# Altium project DDS_PCB.PrjPcb
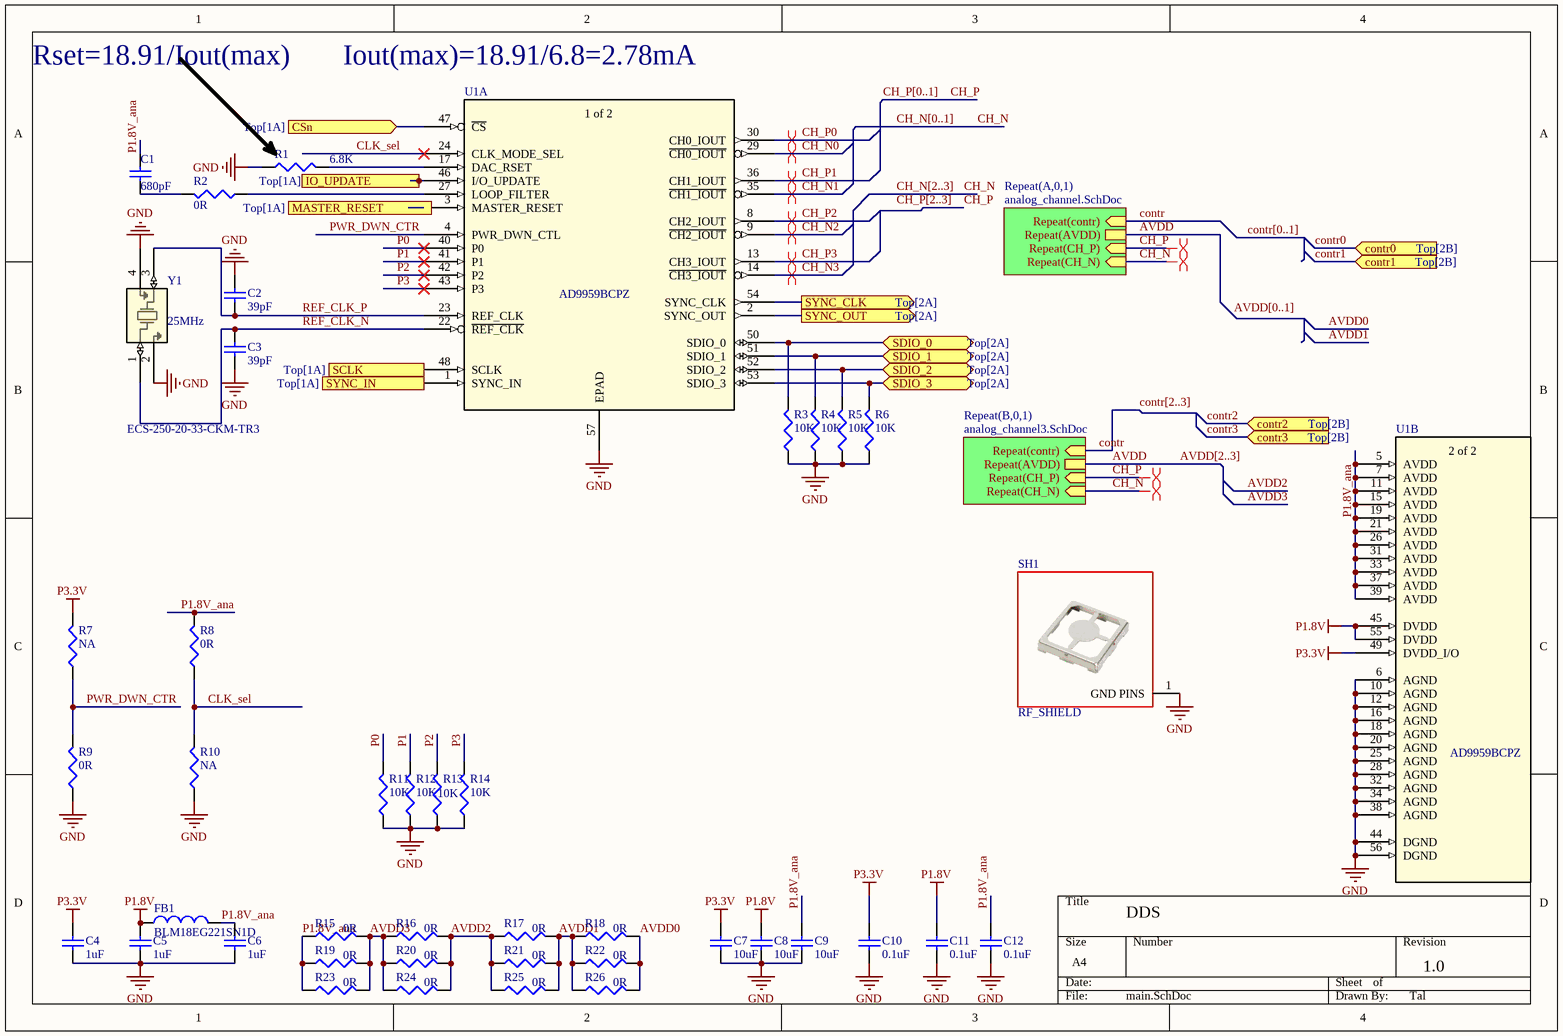
[diagram p0: main.SchDoc]
4 sheets, 213 parts. Net scope: hierarchical (ports join the sheet entries above them; power ports are global).
Board file: DDS_PCB.PcbDoc
Sheets:
  main.SchDoc
    A0 = analog_channel.SchDoc
    A1 = analog_channel.SchDoc
    B0 = analog_channel3.SchDoc
    B1 = analog_channel3.SchDoc
  power.SchDoc

## Sheet main.SchDoc
size A4; SheetNumber: 2; SheetTotal: 6; SPICEModelCacheQOCYWOGJ: <root> / <DocumentId>QOCYWOGJ</DocumentId> / </root>

### Parts
C1  Capacitance: 680pF  [C0402]  (hidden comment: 680pF 50V)
C2  Capacitance: 39pF  [C0402]  (hidden comment: 39pF 50V)
C3  Capacitance: 39pF  [C0402]  (hidden comment: 39pF 50V)
C4  Capacitance: 1uF  [C0402]  (hidden comment: 1uF 25V)
C5  Capacitance: 1uF  [C0402]  (hidden comment: 1uF 25V)
C6  Capacitance: 1uF  [C0402]  (hidden comment: 1uF 25V)
C7  Capacitance: 10uF  [C0402]  (hidden comment: 10uF 10V)
C8  Capacitance: 10uF  [C0402]  (hidden comment: 10uF 10V)
C9  Capacitance: 10uF  [C0402]  (hidden comment: 10uF 10V)
C10  Capacitance: 0.1uF  [C0402]  (hidden comment: 0.1uF 50V)
C11  Capacitance: 0.1uF  [C0402]  (hidden comment: 0.1uF 50V)
C12  Capacitance: 0.1uF  [C0402]  (hidden comment: 0.1uF 50V)
FB1  BLM18EG221SN1D  [fb0603]
R1  6.8K  [R0402]
R2  0R  [R0402]
R3  10K  [R0402]
R4  10K  [R0402]
R5  10K  [R0402]
R6  10K  [R0402]
R7  NA  [R0402]
R8  0R  [R0402]
R9  0R  [R0402]
R10  NA  [R0402]
R11  10K  [R0402]
R12  10K  [R0402]
R13  10K  [R0402]
R14  10K  [R0402]
R15  0R  [R0805]
R16  0R  [R0805]
R17  0R  [R0805]
R18  0R  [R0805]
R19  0R  [R0805]
R20  0R  [R0805]
R21  0R  [R0805]
R22  0R  [R0805]
R23  0R  [R0805]
R24  0R  [R0805]
R25  0R  [R0805]
R26  0R  [R0805]
SH1  RF_SHIELD  [SMS201F]
U1  AD9959BCPZ  [CP_56_1_ADI]  (parts A,B of 2)
Y1  ECS-250-20-33-CKM-TR3  [SMD4_ECX-32_3p2x2p5_ECS]

### Sub-sheets
Repeat(A,0,1) = analog_channel.SchDoc: Repeat(contr) (in), Repeat(AVDD), Repeat(CH_P) (in), Repeat(CH_N) (in)
Repeat(B,0,1) = analog_channel3.SchDoc: Repeat(contr) (in), Repeat(AVDD), Repeat(CH_P) (in), Repeat(CH_N) (in)

### Ports
contr0 (in, see Top[2B]), contr1 (in, see Top[2B]), contr2 (in, see Top[2B]), contr3 (in, see Top[2B]), CSn (in, see Top[1A]), IO_UPDATE (in, see Top[1A]), MASTER_RESET (in, see Top[1A]), SCLK (in, see Top[1A]), SDIO_0 (bidir, see Top[2A]), SDIO_1 (bidir, see Top[2A]), SDIO_2 (bidir, see Top[2A]), SDIO_3 (bidir, see Top[2A]), SYNC_CLK (out, see Top[2A]), SYNC_IN (in, see Top[1A]), SYNC_OUT (out, see Top[2A])

### Nets
GND: C2.2 C3.1 C4.1 C5.1 C6.1 C7.1 C8.1 C9.1 C10.1 C11.1 C12.1 R1.1 R3.1 R4.1 R5.1 R6.1 R9.1 R10.1 R11.1 R12.1 R13.1 R14.1 SH1.1(GND_PINS) U1.6(AGND) U1.10(AGND) U1.12(AGND) U1.16(AGND) U1.18(AGND) U1.20(AGND) U1.25(AGND) U1.28(AGND) U1.32(AGND) U1.34(AGND) U1.38(AGND) U1.44(DGND) U1.56(DGND) U1.57(EPAD) Y1.2 Y1.4
P1.8V: C5.2 C8.2 C11.2 FB1.1 U1.45(DVDD) U1.55(DVDD)
P3.3V: C4.2 C7.2 C10.2 R7.2 U1.49(DVDD_I/O)
AVDD: sheet Repeat(A,0,1)/Repeat(AVDD), sheet Repeat(B,0,1)/Repeat(AVDD)  [also labelled AVDD[2..3]]
AVDD0: R18.2 R22.2 R26.2  [also labelled AVDD[2..3]0]  [project net AVDD]
AVDD1: R17.2 R18.1 R21.2 R22.1 R25.2 R26.1  [also labelled AVDD[2..3]1]  [project net AVDD]
AVDD2: R16.2 R17.1 R20.2 R21.1 R24.2 R25.1
AVDD3: R15.2 R16.1 R19.2 R20.1 R23.2 R24.1
CH_N: sheet Repeat(A,0,1)/Repeat(CH_N), sheet Repeat(B,0,1)/Repeat(CH_N)
CH_N0: U1.29(~{CH0_IOUT})  [project net CH_N]
CH_N1: U1.35(~{CH1_IOUT})  [project net CH_N]
CH_N2: U1.9(~{CH2_IOUT})
CH_N3: U1.14(~{CH3_IOUT})
CH_P: sheet Repeat(A,0,1)/Repeat(CH_P), sheet Repeat(B,0,1)/Repeat(CH_P)
CH_P0: U1.30(CH0_IOUT)  [project net CH_P]
CH_P1: U1.36(CH1_IOUT)  [project net CH_P]
CH_P2: U1.8(CH2_IOUT)
CH_P3: U1.13(CH3_IOUT)
CLK_sel: R8.1 R10.2 U1.24(CLK_MODE_SEL)
contr: sheet Repeat(A,0,1)/Repeat(contr), sheet Repeat(B,0,1)/Repeat(contr)  [also labelled contr[2..3]]
contr2: port contr2
contr3: port contr3
CSn: U1.47(~{CS}) ; port CSn
IO_UPDATE: U1.46(I/O_UPDATE) ; port IO_UPDATE
P0: R11.2 U1.40(P0)
P1: R12.2 U1.41(P1)
P1.8V_ana: C1.1 C6.2 C9.2 C12.2 FB1.2 R8.2 R15.1 R19.1 R23.1 U1.5(AVDD) U1.7(AVDD) U1.11(AVDD) U1.15(AVDD) U1.19(AVDD) U1.21(AVDD) U1.26(AVDD) U1.31(AVDD) U1.33(AVDD) U1.37(AVDD) U1.39(AVDD)
P2: R13.2 U1.42(P2)
P3: R14.2 U1.43(P3)
PWR_DWN_CTR: R7.1 R9.2 U1.4(PWR_DWN_CTL)
REF_CLK_N: C3.2 U1.22(~{REF_CLK}) Y1.1
REF_CLK_P: C2.1 U1.23(REF_CLK) Y1.3
SCLK: U1.48(SCLK) ; port SCLK
SDIO_0: R3.2 U1.50(SDIO_0) ; port SDIO_0
SDIO_1: R4.2 U1.51(SDIO_1) ; port SDIO_1
SDIO_2: R5.2 U1.52(SDIO_2) ; port SDIO_2
SDIO_3: R6.2 U1.53(SDIO_3) ; port SDIO_3
SYNC_CLK: U1.54(SYNC_CLK) ; port SYNC_CLK
SYNC_IN: U1.1(SYNC_IN) ; port SYNC_IN
SYNC_OUT: U1.2(SYNC_OUT) ; port SYNC_OUT
NetC1_2: C1.2 R2.2
NetR1_2: R1.2 U1.17(DAC_RSET)
NetR2_1: R2.1 U1.27(LOOP_FILTER)

Not connected (* = marked no-connect by the designer): U1 3(MASTER_RESET)

### Buses and harness runs
bus AVDD[0..1]
bus CH_N[0..1]
bus CH_N[2..3]
bus CH_P[0..1]
bus CH_P[2..3]
bus contr[0..1]

### Layout directives
differential pair: CH_N, CH_N2, CH_N3, CH_P, CH_P2, CH_P3

### Notes on the sheet
- Rset=18.91/Iout(max)
- Iout(max)=18.91/6.8=2.78mA
- (near Y1) 25MHz
- DDS
- 1.0
- Tal
- Labels drawn without touching a wire or pin: CH_P[2..3]
- (in symbol AD9959BCPZ, part A) 1 of 2
- (in symbol AD9959BCPZ, part B) 2 of 2

### Library data of the parts
C1 = CAP CER 6.8pF 50V NP0 0402: CAP CER 680PF 50V NP0 0402; Manufacturer Part Number: C1005C0G1H6R8D; Manufacturer: TDK Corporation; LANDA P/N: ECP-000033; RoHS: RoHS Compliant; Package / Case: 0402 (1005 Metric); ComponentLink1URL: http://www.tdk.com/pdf/general_B11.pdf; ComponentLink1Description: http://www.tdk.com/pdf/general_B11.pdf; Voltage - Rated: 50V
C2 C3 = CAP CER 6.8pF 50V NP0 0402: CAP CER 39PF 50V NP0 0402; Manufacturer Part Number: C1005C0G1H6R8D; Manufacturer: TDK Corporation; LANDA P/N: ECP-000033; RoHS: RoHS Compliant; Package / Case: 0402 (1005 Metric); ComponentLink1URL: http://www.tdk.com/pdf/general_B11.pdf; ComponentLink1Description: http://www.tdk.com/pdf/general_B11.pdf; Voltage - Rated: 50V
C4-C6 = CAP CER 6.8pF 50V NP0 0402: CAP CER 1uF 25V X5R 0402; Manufacturer Part Number: C1005C0G1H6R8D; Manufacturer: TDK Corporation; LANDA P/N: ECP-000033; Voltage - Rated: 50V; RoHS: RoHS Compliant; Package / Case: 0402 (1005 Metric); ComponentLink1URL: http://www.tdk.com/pdf/general_B11.pdf; ComponentLink1Description: http://www.tdk.com/pdf/general_B11.pdf
C7-C9 = CAP CER 6.8pF 50V NP0 0402: CAP CER 10uF 10V X5R 0402; Manufacturer Part Number: C1005C0G1H6R8D; Manufacturer: TDK Corporation; LANDA P/N: ECP-000033; Voltage - Rated: 50V; RoHS: RoHS Compliant; Package / Case: 0402 (1005 Metric); ComponentLink1URL: http://www.tdk.com/pdf/general_B11.pdf; ComponentLink1Description: http://www.tdk.com/pdf/general_B11.pdf
C10-C12 = CAP CER 6.8pF 50V NP0 0402: CAP CER 0.1uF 50V NP0 0402; Manufacturer Part Number: C1005C0G1H6R8D; Manufacturer: TDK Corporation; LANDA P/N: ECP-000033; RoHS: RoHS Compliant; Package / Case: 0402 (1005 Metric); ComponentLink1URL: http://www.tdk.com/pdf/general_B11.pdf; ComponentLink1Description: http://www.tdk.com/pdf/general_B11.pdf; Voltage - Rated: 50V
FB1 = BK1608HS600-T: FERRITE BEAD 220_OHM@100MHz 0603 2A 50mohm_DC; Manufacturer: Taiyo Yuden; LANDA P/N: EIN-000010; RoHS: RoHS Compliant; Package / Case: 0603 (1608 Metric); ComponentLink1URL: http://www.yuden.co.jp/ut/product/category/emisuppression/BK1608HS600-T.pdf; ComponentLink1Description: http://www.yuden.co.jp/ut/product/category/emisuppression/BK1608HS600-T.pdf; Manufacturer Part Number: BLM18EG221SN1D
R1 = RES 3.09K OHM 1/16W 1% 0402: RES 6.8K OHM 1/16W 1% 0402; Manufacturer Part Number: RMCF0402FT3K09; Manufacturer: Stackpole Electronics Inc; Power (Watts): 0.063W, 1/16W; LANDA P/N: ERS-000063; Supplier Device Package: 0402; Package / Case: 0402 (1005 Metric); RoHS: RoHS Compliant; ComponentLink1URL: http://www.seielect.com/Catalog/SEI-RMCF_RMCP.pdf; ComponentLink1Description: http://www.seielect.com/Catalog/SEI-RMCF_RMCP.pdf
R2 R7-R10 = RES 100 OHM 1/10W 1% 0402 SMD: RES 0 OHM 1/10W 1% 0402 SMD; Manufacturer Part Number: ERJ-2RKF1000X; Manufacturer: Panasonic Electronic Components; LANDA P/N: ERS-000079; Assembly: N.C; Package / Case: 0402 (1005 Metric); RoHS: RoHS Compliant; ComponentLink1URL: http://industrial.panasonic.com/www-cgi/jvcr13pz.cgi?E+PZ+3+AOA0002+ERJ2RKF1000X+7+WW; ComponentLink1Description: http://industrial.panasonic.com/www-cgi/jvcr13pz.cgi?E+PZ+3+AOA0002+ERJ2RKF1000X+7+WW; Supplier Device Package: 0402
R3-R6 R11-R14 = RES 3.09K OHM 1/16W 1% 0402: RES 10K OHM 1/16W 1% 0402; Manufacturer Part Number: RMCF0402FT3K09; Manufacturer: Stackpole Electronics Inc; Power (Watts): 0.063W, 1/16W; LANDA P/N: ERS-000063; Supplier Device Package: 0402; Package / Case: 0402 (1005 Metric); RoHS: RoHS Compliant; ComponentLink1URL: http://www.seielect.com/Catalog/SEI-RMCF_RMCP.pdf; ComponentLink1Description: http://www.seielect.com/Catalog/SEI-RMCF_RMCP.pdf
R15-R26 = RES 200 OHM 1/8W 1% 0805 SMD: RES 0 OHM 1/8W 1% 0805 SMD; Manufacturer Part Number: RMCF0805FT200R; Manufacturer: Stackpole Electronics Inc; Power (Watts): 0.125W, 1/8W; LANDA P/N: ERS-000050; Package / Case: 0805 (2012 Metric); RoHS: RoHS Compliant; Supplier Device Package: 0805; ComponentLink1URL: http://www.seielect.com/Catalog/SEI-RMCF_RMCP.pdf; ComponentLink1Description: http://www.seielect.com/Catalog/SEI-RMCF_RMCP.pdf
SH1 = RF_SHIELD: RF SHIELD 0.5" X 0.538" SMD; Manufacturer_Part_Number: SMS-201F; Manufacturer: Leader Tech Inc.; ComponentLink1Description: Datasheet; ComponentLink1URL: https://www.leadertechinc.com/assets/files/EngineeringDrawings/SMS-201.pdf
U1 = AD9959BCPZ: No Description Available; Mfr_Name: Analog Devices Inc; Copyright: Copyright (C) 2023 Ultra Librarian. All rights reserved.; Manufacturer_Part_Number: AD9959BCPZ; RefDes: RefDes; Type: DEV
Y1 = ECS-250-20-33-CKM-TR3: No Description Available; Mfr_Name: ECS International; Type: DEV; Copyright: Copyright (C) 2023 Ultra Librarian. All rights reserved.; Manufacturer_Part_Number: ECS-250-20-33-CKM-TR3; RefDes: RefDes

## Sheet analog_channel.SchDoc
size A4; SheetNumber: 3; SheetTotal: 6
Used 2 times, as channels A0, A1. Parts and nets are listed once, with the designators drawn on the sheet.
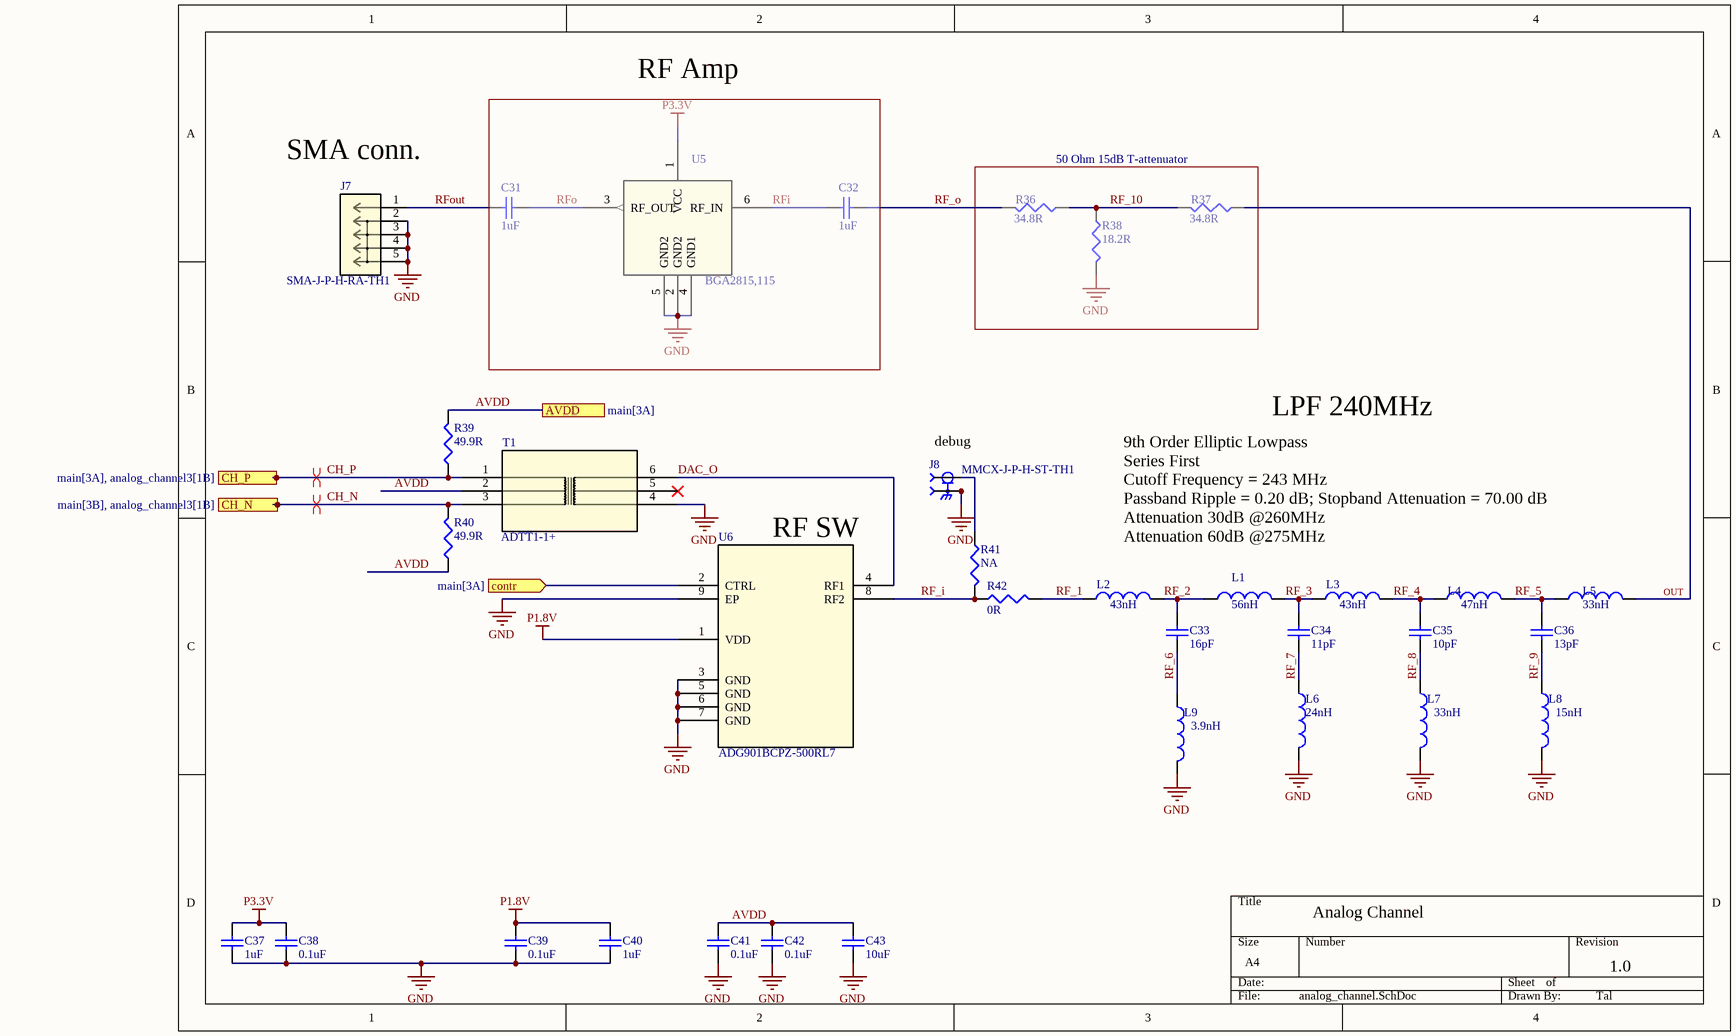
[diagram p1: analog_channel.SchDoc]

### Parts
C31  Capacitance: 1uF  [C0402]  (hidden comment: 1uF 25V)
C32  Capacitance: 1uF  [C0402]  (hidden comment: 1uF 25V)
C33  Capacitance: 16pF  [C0402]  (hidden comment: 16pF 50V)
C34  Capacitance: 11pF  [C0402]  (hidden comment: 11pF 50V)
C35  Capacitance: 10pF  [C0402]  (hidden comment: 10pF 50V)
C36  Capacitance: 13pF  [C0402]  (hidden comment: 13pF 50V)
C37  Capacitance: 1uF  [C0402]  (hidden comment: 1uF 25V)
C38  Capacitance: 0.1uF  [C0402]  (hidden comment: 0.1uF 50V)
C39  Capacitance: 0.1uF  [C0402]  (hidden comment: 0.1uF 50V)
C40  Capacitance: 1uF  [C0402]  (hidden comment: 1uF 25V)
C41  Capacitance: 0.1uF  [C0402]  (hidden comment: 0.1uF 50V)
C42  Capacitance: 0.1uF  [C0402]  (hidden comment: 0.1uF 50V)
C43  Capacitance: 10uF  [C0402]  (hidden comment: 10uF 10V)
J7  SMA-J-P-H-RA-TH1  [CONN_SMA-J-P-H-RA-TH1_SAI]
J8  MMCX-J-P-H-ST-TH1  [SAMTEC_MMCX-J-P-H-ST-TH1]
L1  value 56nH  [0402-A]  (hidden comment: Inductor)
L2  value 43nH  [0402-A]  (hidden comment: Inductor)
L3  value 43nH  [0402-A]  (hidden comment: Inductor)
L4  value 47nH  [0402-A]  (hidden comment: Inductor)
L5  value 33nH  [0402-A]  (hidden comment: Inductor)
L6  value 24nH  [0402-A]  (hidden comment: Inductor)
L7  value 33nH  [0402-A]  (hidden comment: Inductor)
L8  value 15nH  [0402-A]  (hidden comment: Inductor)
L9  value 3.9nH  [0402-A]  (hidden comment: Inductor)
R36  34.8R  [r0402]
R37  34.8R  [r0402]
R38  18.2R  [r0402]
R39  49.9R  [R0402]
R40  49.9R  [R0402]
R41  NA  [r0402]
R42  0R  [r0402]
T1  ADTT1-1+  [CD542_MNC]
U5  BGA2815,115  [SOT_2815,115_NXP]
U6  ADG901BCPZ-500RL7  [CP_8_2_ADI]

### Blocks framed on the sheet
RF Amp: C31 C32 U5
50 Ohm 15dB T-attenuator: R36-R38

### Ports
AVDD (see main[3A]), CH_N (in, see main[3B], analog_channel3[1B]), CH_P (in, see main[3A], analog_channel3[1B]), contr (in, see main[3A])

### Nets
GND: C37.1 C38.1 C39.1 C40.1 C41.1 C42.1 C43.1 J7.2 J7.3 J7.4 J7.5 J8.S1 J8.S2 J8.S3 J8.S4 L6.2 L7.2 L8.2 L9.2 R38.2 T1.4 U5.2(GND2) U5.4(GND1) U5.5(GND2) U6.3(GND) U6.5(GND) U6.6(GND) U6.7(GND) U6.9(EP)
P1.8V: C39.2 C40.2 U6.1(VDD)
P3.3V: C37.2 C38.2 U5.1(VCC)
AVDD: C41.2 C42.2 C43.2 R39.2 R40.1 T1.2 ; port AVDD
CH_N: R40.2 T1.3 ; port CH_N
CH_P: R39.1 T1.1 ; port CH_P
contr: U6.2(CTRL) ; port contr
DAC_O: T1.6 U6.4(RF1)
OUT: L5.2 R37.1
RF_1: L2.1 R42.2
RF_2: C33.1 L1.1 L2.2
RF_3: C34.1 L1.2 L3.1
RF_4: C35.1 L3.2 L4.1
RF_5: C36.1 L4.2 L5.1
RF_6: C33.2 L9.1
RF_7: C34.2 L6.1
RF_8: C35.2 L7.1
RF_9: C36.2 L8.1
RF_10: R36.1 R37.2 R38.1
RF_i: R41.2 R42.1 U6.8(RF2)
RF_o: C32.2 R36.2
RFi: C32.1 U5.6(RF_IN)
RFo: C31.2 U5.3(RF_OUT)
RFout: C31.1 J7.1
NetJ8_1: J8.1 R41.1

Not connected (* = marked no-connect by the designer): T1 5*

### Channels
A0: designators end in _A0; ports AVDD=AVDD CH_N=CH_N CH_P=CH_P contr=contr0
A1: designators end in _A1; ports AVDD=AVDD CH_N=CH_N CH_P=CH_P contr=contr1

### Layout directives
differential pair: CH_N, CH_P

### Notes on the sheet
- (near J7) SMA conn.
- (near J8) debug
- LPF 240MHz
- (near U6) RF SW
- 9th Order Elliptic Lowpass
  Series First
  Cutoff Frequency = 243 MHz
  Passband Ripple = 0.20 dB; Stopband Attenuation = 70.00 dB
  Attenuation 30dB @260MHz
  Attenuation 60dB @275MHz
- Analog Channel
- 1.0
- Tal

### Library data of the parts
C31 C32 C37 C40 = CAP CER 6.8pF 50V NP0 0402: as C4 on sheet main; RoHS: RoHS Compliant; Package / Case: 0402 (1005 Metric); ComponentLink1URL: http://www.tdk.com/pdf/general_B11.pdf; ComponentLink1Description: http://www.tdk.com/pdf/general_B11.pdf
C33 = CAP CER 20pF 50V 5% NP0 0402: CAP CER 16PF 50V 5% NP0 0402; Manufacturer: TDK Corporation; Manufacturer Part Number: C1005C0G1H200J; LANDA P/N: ECP-000034; Package / Case: 0402 (1005 Metric); RoHS: RoHS Compliant; ComponentLink1URL: http://www.tdk.com/pdf/general_B11.pdf; ComponentLink1Description: http://www.tdk.com/pdf/general_B11.pdf; Voltage - Rated: 50V
C34 = CAP CER 20pF 50V 5% NP0 0402: CAP CER 11PF 50V 5% NP0 0402; Manufacturer: TDK Corporation; Manufacturer Part Number: C1005C0G1H200J; LANDA P/N: ECP-000034; Package / Case: 0402 (1005 Metric); RoHS: RoHS Compliant; ComponentLink1URL: http://www.tdk.com/pdf/general_B11.pdf; ComponentLink1Description: http://www.tdk.com/pdf/general_B11.pdf; Voltage - Rated: 50V
C35 = CAP CER 20pF 50V 5% NP0 0402: CAP CER 10PF 50V 5% NP0 0402; Manufacturer: TDK Corporation; Manufacturer Part Number: C1005C0G1H200J; LANDA P/N: ECP-000034; Package / Case: 0402 (1005 Metric); RoHS: RoHS Compliant; ComponentLink1URL: http://www.tdk.com/pdf/general_B11.pdf; ComponentLink1Description: http://www.tdk.com/pdf/general_B11.pdf; Voltage - Rated: 50V
C36 = CAP CER 20pF 50V 5% NP0 0402: CAP CER 13PF 50V 5% NP0 0402; Manufacturer: TDK Corporation; Manufacturer Part Number: C1005C0G1H200J; LANDA P/N: ECP-000034; Package / Case: 0402 (1005 Metric); RoHS: RoHS Compliant; ComponentLink1URL: http://www.tdk.com/pdf/general_B11.pdf; ComponentLink1Description: http://www.tdk.com/pdf/general_B11.pdf; Voltage - Rated: 50V
C38 C39 C41 C42 = CAP CER 6.8pF 50V NP0 0402: as C10 on sheet main; RoHS: RoHS Compliant; Package / Case: 0402 (1005 Metric); ComponentLink1URL: http://www.tdk.com/pdf/general_B11.pdf; ComponentLink1Description: http://www.tdk.com/pdf/general_B11.pdf; Voltage - Rated: 50V
C43 = CAP CER 6.8pF 50V NP0 0402: as C7 on sheet main; RoHS: RoHS Compliant; Package / Case: 0402 (1005 Metric); ComponentLink1URL: http://www.tdk.com/pdf/general_B11.pdf; ComponentLink1Description: http://www.tdk.com/pdf/general_B11.pdf
J7 = SMA-J-P-H-RA-TH1: No Description Available; Mfr_Name: Samtec Inc; Copyright: Copyright (C) 2023 Ultra Librarian. All rights reserved.; Manufacturer_Part_Number: SMA-J-P-H-RA-TH1; RefDes: RefDes; Type: DEV
J8 = MMCX-J-P-H-ST-TH1: MMCX STRAIGHT, THROUGH HOLE JACK- 50 OHM; MF: Samtec; MP: MMCX-J-P-H-ST-TH1; Price: None; Package: None; Value: *; Availability: Unavailable
L1-L9 = Inductor: Code_IEC: 1005; Published: 8-Jun-2000; LatestRevisionDate: 29-May-2009; LatestRevisionNote: IPC-7351 Footprint Added.; PackageReference: 0402-A; Publisher: Altium Limited; PackageDescription: Chip Inductor; Code_JEITA: 0402
R36 R37 = RES 100 OHM 1/10W 1% 0402 SMD: RES 34.8 OHM 1/10W 1% 0402 SMD; Manufacturer Part Number: ERJ-2RKF1000X; Manufacturer: Panasonic Electronic Components; LANDA P/N: ERS-000079; Assembly: N.C; Package / Case: 0402 (1005 Metric); RoHS: RoHS Compliant; ComponentLink1URL: http://industrial.panasonic.com/www-cgi/jvcr13pz.cgi?E+PZ+3+AOA0002+ERJ2RKF1000X+7+WW; ComponentLink1Description: http://industrial.panasonic.com/www-cgi/jvcr13pz.cgi?E+PZ+3+AOA0002+ERJ2RKF1000X+7+WW; Supplier Device Package: 0402
R38 = RES 100 OHM 1/10W 1% 0402 SMD: RES 18.2 OHM 1/10W 1% 0402 SMD; Manufacturer Part Number: ERJ-2RKF1000X; Manufacturer: Panasonic Electronic Components; LANDA P/N: ERS-000079; Assembly: N.C; Package / Case: 0402 (1005 Metric); RoHS: RoHS Compliant; ComponentLink1URL: http://industrial.panasonic.com/www-cgi/jvcr13pz.cgi?E+PZ+3+AOA0002+ERJ2RKF1000X+7+WW; ComponentLink1Description: http://industrial.panasonic.com/www-cgi/jvcr13pz.cgi?E+PZ+3+AOA0002+ERJ2RKF1000X+7+WW; Supplier Device Package: 0402
R39 R40 = RES 100 OHM 1/10W 1% 0402 SMD: RES 49.9 OHM 1/10W 1% 0402 SMD; Manufacturer Part Number: ERJ-2RKF1000X; Manufacturer: Panasonic Electronic Components; LANDA P/N: ERS-000079; Assembly: N.C; Package / Case: 0402 (1005 Metric); RoHS: RoHS Compliant; ComponentLink1URL: http://industrial.panasonic.com/www-cgi/jvcr13pz.cgi?E+PZ+3+AOA0002+ERJ2RKF1000X+7+WW; ComponentLink1Description: http://industrial.panasonic.com/www-cgi/jvcr13pz.cgi?E+PZ+3+AOA0002+ERJ2RKF1000X+7+WW; Supplier Device Package: 0402
R41 R42 = RES 100 OHM 1/10W 1% 0402 SMD: as R2 on sheet main; Package / Case: 0402 (1005 Metric); RoHS: RoHS Compliant; ComponentLink1URL: http://industrial.panasonic.com/www-cgi/jvcr13pz.cgi?E+PZ+3+AOA0002+ERJ2RKF1000X+7+WW; ComponentLink1Description: http://industrial.panasonic.com/www-cgi/jvcr13pz.cgi?E+PZ+3+AOA0002+ERJ2RKF1000X+7+WW; Supplier Device Package: 0402
T1 = ADTT1-1+: No Description Available; Mfr_Name: Mini Circuits; Type: DEV; Copyright: Copyright (C) 2023 Ultra Librarian. All rights reserved.; Manufacturer_Part_Number: ADTT1-1+; RefDes: RefDes
U5 = BGA2815,115: No Description Available; Mfr_Name: NXP; Copyright: Copyright (C) 2023 Ultra Librarian. All rights reserved.; Manufacturer_Part_Number: BGA2815,115; RefDes: RefDes; Type: DEV
U6 = ADG901BCPZ-500RL7: No Description Available; Mfr_Name: Analog Devices Inc; Copyright: Copyright (C) 2023 Ultra Librarian. All rights reserved.; Manufacturer_Part_Number: ADG901BCPZ-500RL7; RefDes: RefDes; Type: DEV

## Sheet analog_channel3.SchDoc
size A4; SheetNumber: 4; SheetTotal: 6
Used 2 times, as channels B0, B1. Parts and nets are listed once, with the designators drawn on the sheet.
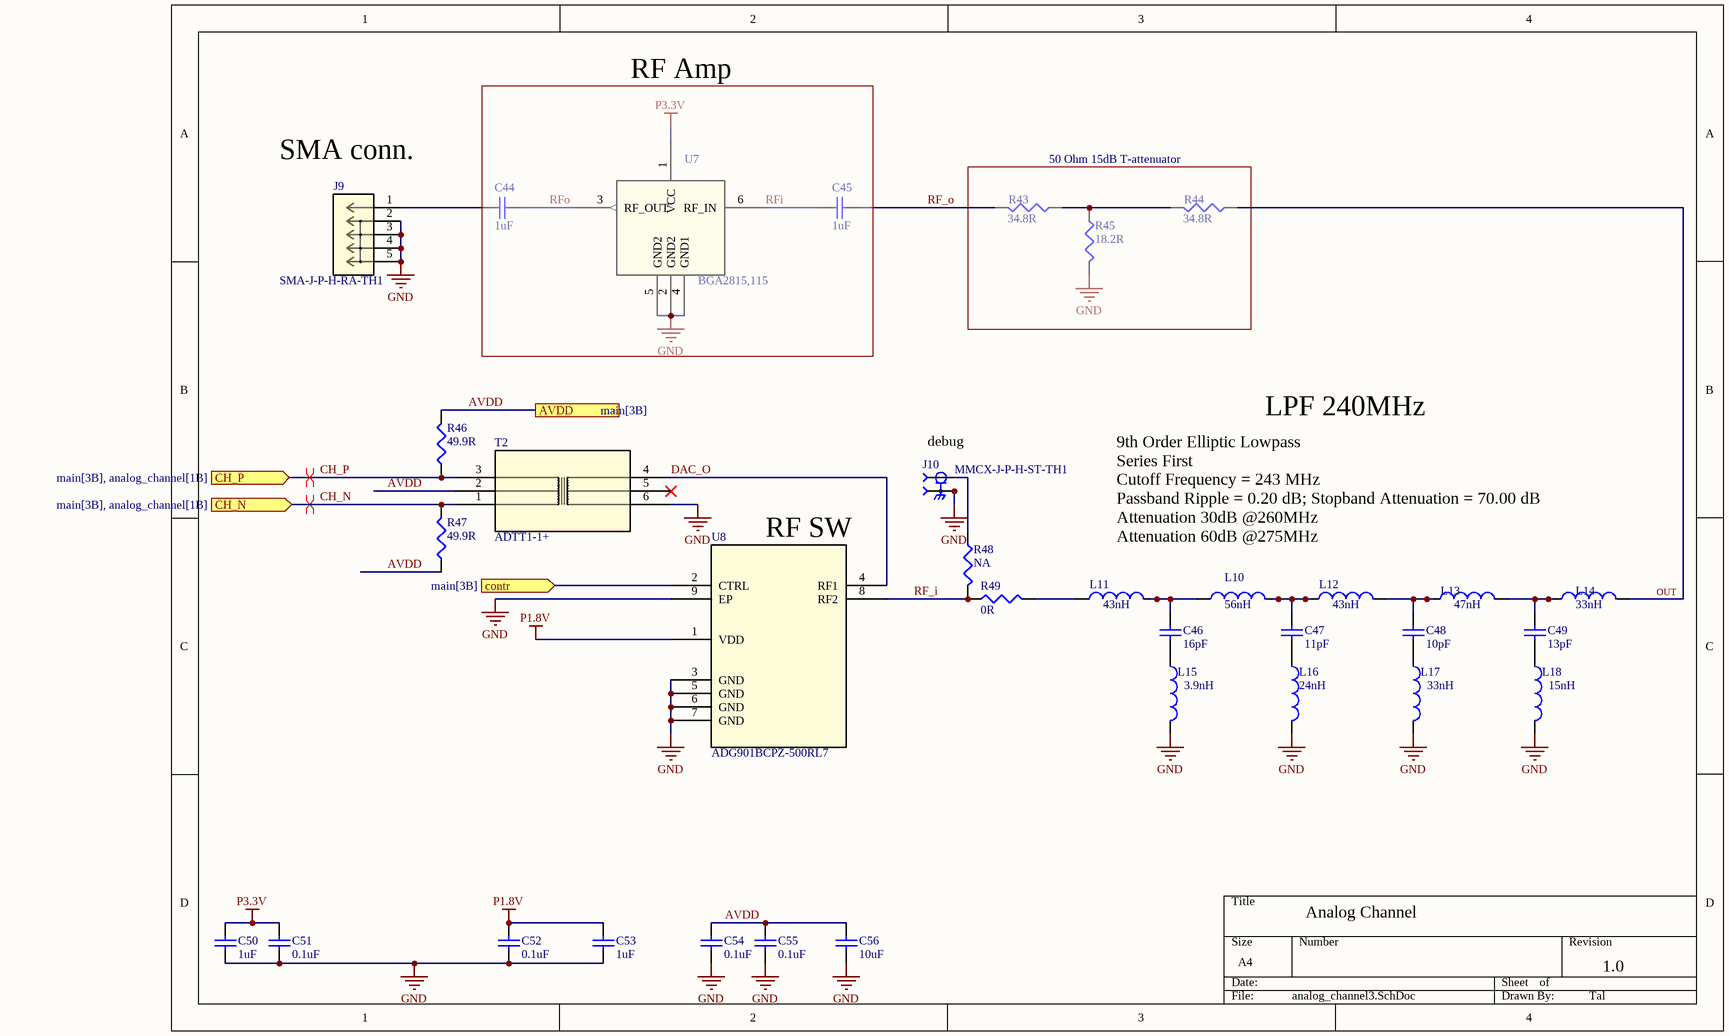
[diagram p2: analog_channel3.SchDoc]

### Parts
C44  Capacitance: 1uF  [c0402]  (hidden comment: 1uF 25V)
C45  Capacitance: 1uF  [c0402]  (hidden comment: 1uF 25V)
C46  Capacitance: 16pF  [c0402]  (hidden comment: 16pF 50V)
C47  Capacitance: 11pF  [c0402]  (hidden comment: 11pF 50V)
C48  Capacitance: 10pF  [c0402]  (hidden comment: 10pF 50V)
C49  Capacitance: 13pF  [c0402]  (hidden comment: 13pF 50V)
C50  Capacitance: 1uF  [c0402]  (hidden comment: 1uF 25V)
C51  Capacitance: 0.1uF  [c0402]  (hidden comment: 0.1uF 50V)
C52  Capacitance: 0.1uF  [c0402]  (hidden comment: 0.1uF 50V)
C53  Capacitance: 1uF  [c0402]  (hidden comment: 1uF 25V)
C54  Capacitance: 0.1uF  [c0402]  (hidden comment: 0.1uF 50V)
C55  Capacitance: 0.1uF  [c0402]  (hidden comment: 0.1uF 50V)
C56  Capacitance: 10uF  [c0402]  (hidden comment: 10uF 10V)
J9  SMA-J-P-H-RA-TH1  [CONN_SMA-J-P-H-RA-TH1_SAI]
J10  MMCX-J-P-H-ST-TH1  [SAMTEC_MMCX-J-P-H-ST-TH1]
L10  value 56nH  [0402-A]  (hidden comment: Inductor)
L11  value 43nH  [0402-A]  (hidden comment: Inductor)
L12  value 43nH  [0402-A]  (hidden comment: Inductor)
L13  value 47nH  [0402-A]  (hidden comment: Inductor)
L14  value 33nH  [0402-A]  (hidden comment: Inductor)
L15  value 3.9nH  [0402-A]  (hidden comment: Inductor)
L16  value 24nH  [0402-A]  (hidden comment: Inductor)
L17  value 33nH  [0402-A]  (hidden comment: Inductor)
L18  value 15nH  [0402-A]  (hidden comment: Inductor)
R43  34.8R  [r0402]
R44  34.8R  [r0402]
R45  18.2R  [r0402]
R46  49.9R  [r0402]
R47  49.9R  [r0402]
R48  NA  [r0402]
R49  0R  [r0402]
T2  ADTT1-1+  [CD542_MNC]
U7  BGA2815,115  [SOT_2815,115_NXP]
U8  ADG901BCPZ-500RL7  [CP_8_2_ADI]

### Blocks framed on the sheet
RF Amp: C44 C45 U7
50 Ohm 15dB T-attenuator: R43-R45

### Ports
AVDD (see main[3B]), CH_N (in, see main[3B], analog_channel[1B]), CH_P (in, see main[3B], analog_channel[1B]), contr (in, see main[3B])

### Nets
GND: C50.1 C51.1 C52.1 C53.1 C54.1 C55.1 C56.1 J9.2 J9.3 J9.4 J9.5 J10.S1 J10.S2 J10.S3 J10.S4 L15.2 L16.2 L17.2 L18.2 R45.2 T2.6 U7.2(GND2) U7.4(GND1) U7.5(GND2) U8.3(GND) U8.5(GND) U8.6(GND) U8.7(GND) U8.9(EP)
P1.8V: C52.2 C53.2 U8.1(VDD)
P3.3V: C50.2 C51.2 U7.1(VCC)
AVDD: C54.2 C55.2 C56.2 R46.2 R47.1 T2.2 ; port AVDD
CH_N: R47.2 T2.1 ; port CH_N
CH_P: R46.1 T2.3 ; port CH_P
contr: U8.2(CTRL) ; port contr
DAC_O: T2.4 U8.4(RF1)
OUT: L14.2 R44.1
RF_i: R48.2 R49.1 U8.8(RF2)
RF_o: C45.2 R43.2
RFi: C45.1 U7.6(RF_IN)
RFo: C44.2 U7.3(RF_OUT)
NetC44_1: C44.1 J9.1
NetC46_1: C46.1 L10.1 L11.2
NetC46_2: C46.2 L15.1
NetC47_1: C47.1 L10.2 L12.1
NetC47_2: C47.2 L16.1
NetC48_1: C48.1 L12.2 L13.1
NetC48_2: C48.2 L17.1
NetC49_1: C49.1 L13.2 L14.1
NetC49_2: C49.2 L18.1
NetJ10_1: J10.1 R48.1
NetL11_1: L11.1 R49.2
NetR43_1: R43.1 R44.2 R45.1

Not connected (* = marked no-connect by the designer): T2 5*

### Channels
B0: designators end in _B0; ports AVDD=AVDD CH_N=CH_N CH_P=CH_P contr=contr0
B1: designators end in _B1; ports AVDD=AVDD CH_N=CH_N CH_P=CH_P contr=contr1

### Layout directives
differential pair: CH_N, CH_P

### Notes on the sheet
- (near J9) SMA conn.
- (near J10) debug
- LPF 240MHz
- (near U8) RF SW
- 9th Order Elliptic Lowpass
  Series First
  Cutoff Frequency = 243 MHz
  Passband Ripple = 0.20 dB; Stopband Attenuation = 70.00 dB
  Attenuation 30dB @260MHz
  Attenuation 60dB @275MHz
- Analog Channel
- 1.0
- Tal

### Library data of the parts
C44 C45 C50 C53 = CAP CER 6.8pF 50V NP0 0402: as C4 on sheet main; RoHS: RoHS Compliant; Package / Case: 0402 (1005 Metric); ComponentLink1URL: http://www.tdk.com/pdf/general_B11.pdf; ComponentLink1Description: http://www.tdk.com/pdf/general_B11.pdf
C46 = CAP CER 20pF 50V 5% NP0 0402: as C33 on sheet analog_channel; Package / Case: 0402 (1005 Metric); RoHS: RoHS Compliant; ComponentLink1URL: http://www.tdk.com/pdf/general_B11.pdf; ComponentLink1Description: http://www.tdk.com/pdf/general_B11.pdf; Voltage - Rated: 50V
C47 = CAP CER 20pF 50V 5% NP0 0402: as C34 on sheet analog_channel; Package / Case: 0402 (1005 Metric); RoHS: RoHS Compliant; ComponentLink1URL: http://www.tdk.com/pdf/general_B11.pdf; ComponentLink1Description: http://www.tdk.com/pdf/general_B11.pdf; Voltage - Rated: 50V
C48 = CAP CER 20pF 50V 5% NP0 0402: as C35 on sheet analog_channel; Package / Case: 0402 (1005 Metric); RoHS: RoHS Compliant; ComponentLink1URL: http://www.tdk.com/pdf/general_B11.pdf; ComponentLink1Description: http://www.tdk.com/pdf/general_B11.pdf; Voltage - Rated: 50V
C49 = CAP CER 20pF 50V 5% NP0 0402: as C36 on sheet analog_channel; Package / Case: 0402 (1005 Metric); RoHS: RoHS Compliant; ComponentLink1URL: http://www.tdk.com/pdf/general_B11.pdf; ComponentLink1Description: http://www.tdk.com/pdf/general_B11.pdf; Voltage - Rated: 50V
C51 C52 C54 C55 = CAP CER 6.8pF 50V NP0 0402: as C10 on sheet main; RoHS: RoHS Compliant; Package / Case: 0402 (1005 Metric); ComponentLink1URL: http://www.tdk.com/pdf/general_B11.pdf; ComponentLink1Description: http://www.tdk.com/pdf/general_B11.pdf; Voltage - Rated: 50V
C56 = CAP CER 6.8pF 50V NP0 0402: as C7 on sheet main; RoHS: RoHS Compliant; Package / Case: 0402 (1005 Metric); ComponentLink1URL: http://www.tdk.com/pdf/general_B11.pdf; ComponentLink1Description: http://www.tdk.com/pdf/general_B11.pdf
J9 = SMA-J-P-H-RA-TH1: as J7 on sheet analog_channel; Copyright: Copyright (C) 2023 Ultra Librarian. All rights reserved.; Manufacturer_Part_Number: SMA-J-P-H-RA-TH1; RefDes: RefDes; Type: DEV
J10 = MMCX-J-P-H-ST-TH1: as J8 on sheet analog_channel; MP: MMCX-J-P-H-ST-TH1; Price: None; Package: None; Value: *; Availability: Unavailable
L10-L18 = Inductor: Code_IEC: 1005; Published: 8-Jun-2000; LatestRevisionDate: 29-May-2009; LatestRevisionNote: IPC-7351 Footprint Added.; PackageReference: 0402-A; Publisher: Altium Limited; PackageDescription: Chip Inductor; Code_JEITA: 0402
R43 R44 = RES 100 OHM 1/10W 1% 0402 SMD: as R36 on sheet analog_channel; Package / Case: 0402 (1005 Metric); RoHS: RoHS Compliant; ComponentLink1URL: http://industrial.panasonic.com/www-cgi/jvcr13pz.cgi?E+PZ+3+AOA0002+ERJ2RKF1000X+7+WW; ComponentLink1Description: http://industrial.panasonic.com/www-cgi/jvcr13pz.cgi?E+PZ+3+AOA0002+ERJ2RKF1000X+7+WW; Supplier Device Package: 0402
R45 = RES 100 OHM 1/10W 1% 0402 SMD: as R38 on sheet analog_channel; Package / Case: 0402 (1005 Metric); RoHS: RoHS Compliant; ComponentLink1URL: http://industrial.panasonic.com/www-cgi/jvcr13pz.cgi?E+PZ+3+AOA0002+ERJ2RKF1000X+7+WW; ComponentLink1Description: http://industrial.panasonic.com/www-cgi/jvcr13pz.cgi?E+PZ+3+AOA0002+ERJ2RKF1000X+7+WW; Supplier Device Package: 0402
R46 R47 = RES 100 OHM 1/10W 1% 0402 SMD: as R39 on sheet analog_channel; Package / Case: 0402 (1005 Metric); RoHS: RoHS Compliant; ComponentLink1URL: http://industrial.panasonic.com/www-cgi/jvcr13pz.cgi?E+PZ+3+AOA0002+ERJ2RKF1000X+7+WW; ComponentLink1Description: http://industrial.panasonic.com/www-cgi/jvcr13pz.cgi?E+PZ+3+AOA0002+ERJ2RKF1000X+7+WW; Supplier Device Package: 0402
R48 R49 = RES 100 OHM 1/10W 1% 0402 SMD: as R2 on sheet main; Package / Case: 0402 (1005 Metric); RoHS: RoHS Compliant; ComponentLink1URL: http://industrial.panasonic.com/www-cgi/jvcr13pz.cgi?E+PZ+3+AOA0002+ERJ2RKF1000X+7+WW; ComponentLink1Description: http://industrial.panasonic.com/www-cgi/jvcr13pz.cgi?E+PZ+3+AOA0002+ERJ2RKF1000X+7+WW; Supplier Device Package: 0402
T2 = ADTT1-1+: as T1 on sheet analog_channel; Copyright: Copyright (C) 2023 Ultra Librarian. All rights reserved.; Manufacturer_Part_Number: ADTT1-1+; RefDes: RefDes
U7 = BGA2815,115: No Description Available; Mfr_Name: NXP; Copyright: Copyright (C) 2023 Ultra Librarian. All rights reserved.; Manufacturer_Part_Number: BGA2815,115; RefDes: RefDes; Type: DEV
U8 = ADG901BCPZ-500RL7: as U6 on sheet analog_channel; Copyright: Copyright (C) 2023 Ultra Librarian. All rights reserved.; Manufacturer_Part_Number: ADG901BCPZ-500RL7; RefDes: RefDes; Type: DEV

## Sheet power.SchDoc
size A4; SheetNumber: 5; SheetTotal: 6
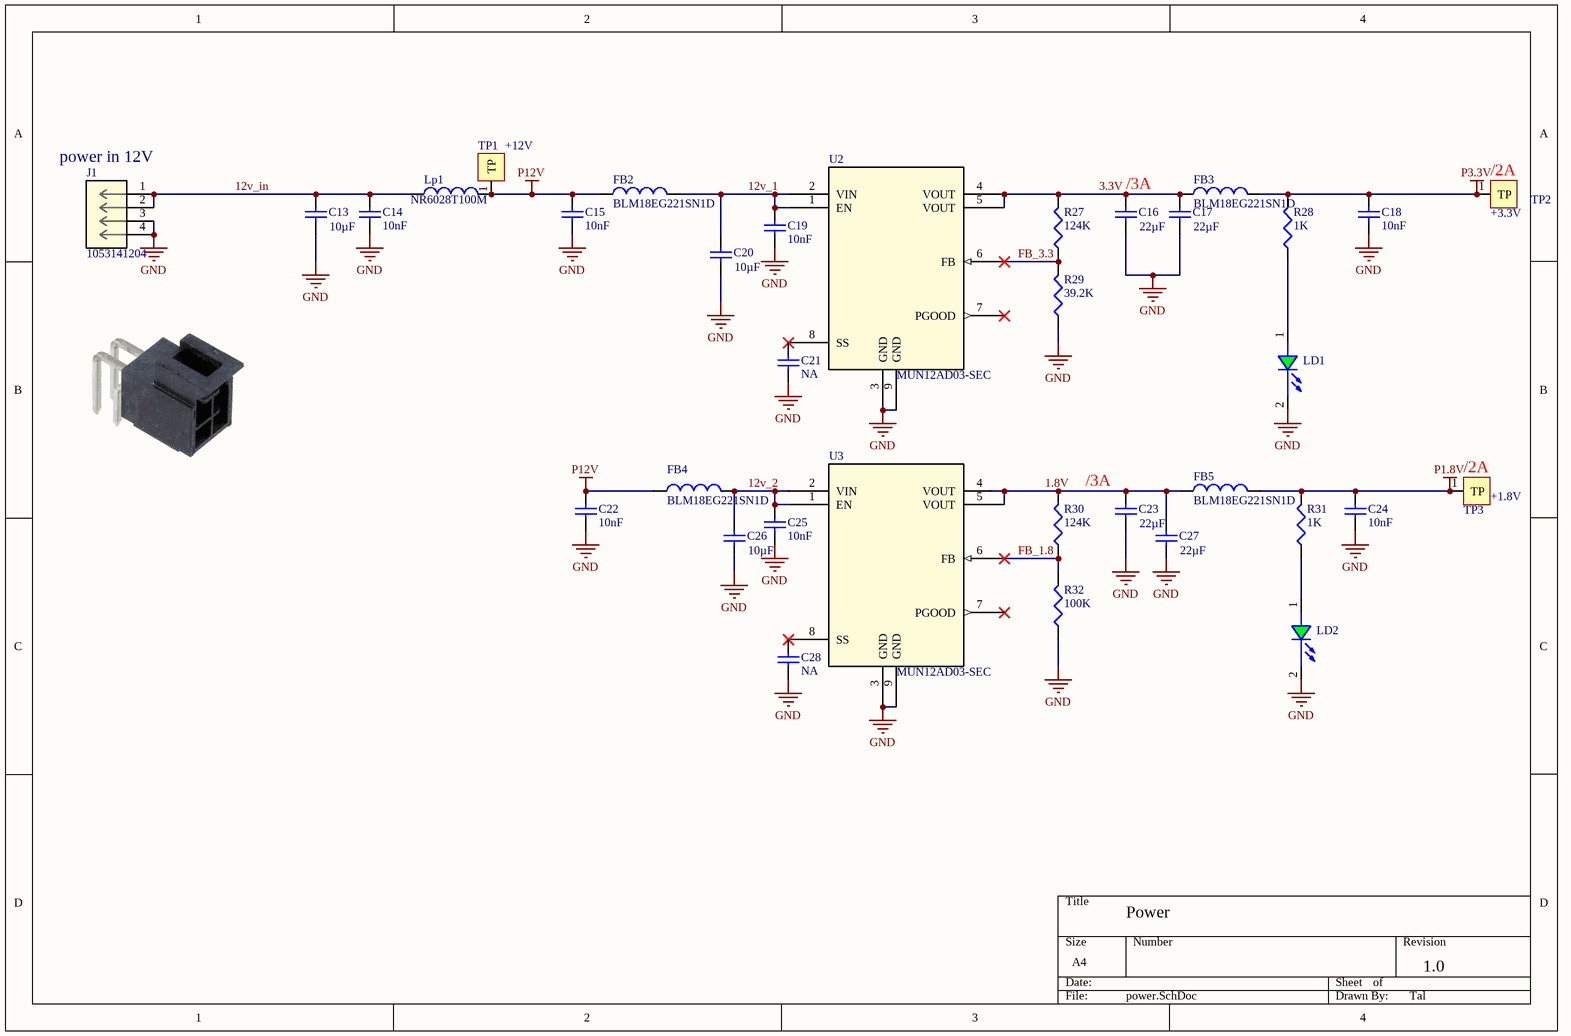
[diagram p3: power.SchDoc]

### Parts
C13  Capacitance: 10µF  [C0603]  (hidden comment: 10uF 25V)
C14  Capacitance: 10nF  [C0402]  (hidden comment: 10nF 25V)
C15  Capacitance: 10nF  [C0402]  (hidden comment: 10nF 25V)
C16  Capacitance: 22µF  [C0603]  (hidden comment: 22uF 16V)
C17  Capacitance: 22µF  [C0603]  (hidden comment: 22uF 16V)
C18  Capacitance: 10nF  [C0402]  (hidden comment: 10nF 25V)
C19  Capacitance: 10nF  [C0402]  (hidden comment: 10nF 25V)
C20  Capacitance: 10µF  [C0603]  (hidden comment: 10uF 25V)
C21  NA  [C0402]
C22  Capacitance: 10nF  [C0402]  (hidden comment: 10nF 25V)
C23  Capacitance: 22µF  [C0603]  (hidden comment: 22uF 16V)
C24  Capacitance: 10nF  [C0402]  (hidden comment: 10nF 25V)
C25  Capacitance: 10nF  [C0402]  (hidden comment: 10nF 25V)
C26  Capacitance: 10µF  [C0603]  (hidden comment: 10uF 25V)
C27  Capacitance: 22µF  [C0603]  (hidden comment: 22uF 16V)
C28  NA  [C0402]
FB2  BLM18EG221SN1D  [fb0603]
FB3  BLM18EG221SN1D  [FB0603]
FB4  BLM18EG221SN1D  [fb0603]
FB5  BLM18EG221SN1D  [fb0603]
J1  1053141204  [CON_1053141204]
LD1  APT1608SGC  [LED_0603_Green]  (value not drawn)
LD2  APT1608SGC  [LED_0603_Green]  (value not drawn)
Lp1  NR6028T100M  [ind6x6_H3]
R27  124K  [R0402]
R28  1K  [R0402]
R29  39.2K  [R0402]
R30  124K  [R0402]
R31  1K  [R0402]
R32  100K  [R0402]
TP1  +12V  [TP_2x1.8]
TP2  +3.3V  [TP_2x1.8]
TP3  +1.8V  [TP_2x1.8]
U2  MUN12AD03-SEC  [SO8_MUN12AD_DEA]
U3  MUN12AD03-SEC  [SO8_MUN12AD_DEA]

### Nets
GND: C13.1 C14.1 C15.1 C16.1 C17.1 C18.1 C19.1 C20.1 C21.1 C22.1 C23.1 C24.1 C25.1 C26.1 C27.1 C28.1 J1.3 J1.4 LD1.2(CATHODE) LD2.2(CATHODE) R29.1 R32.1 U2.3(GND) U2.9(GND) U3.3(GND) U3.9(GND)
P1.8V: C24.2 FB5.2 R31.2 TP3.1(TP)
P3.3V: C18.2 FB3.2 R28.2 TP2.1(TP)
P12V: C15.2 C22.2 FB2.1 FB4.1 Lp1.2 TP1.1(TP)
1.8V: C23.2 C27.2 FB5.1 R30.2 U3.4(VOUT) U3.5(VOUT)
3.3V: C16.2 C17.2 FB3.1 R27.2 U2.4(VOUT) U2.5(VOUT)
12v_1: C19.2 C20.2 FB2.2 U2.1(EN) U2.2(VIN)
12v_2: C25.2 C26.2 FB4.2 U3.1(EN) U3.2(VIN)
12v_in: C13.2 C14.2 J1.1 J1.2 Lp1.1
FB_1.8: R30.1 R32.2 U3.6(FB)
FB_3.3: R27.1 R29.2 U2.6(FB)
NetC21_2: C21.2 U2.8(SS)
NetC28_2: C28.2 U3.8(SS)
NetLD1_1: LD1.1(ANODE) R28.1
NetLD2_1: LD2.1(ANODE) R31.1

Not connected (* = marked no-connect by the designer): U2 7(PGOOD)*; U3 7(PGOOD)*

### Notes on the sheet
- (near J1) power in 12V
- (near TP2) /2A
- (near C16) /3A
- /3A
- (near TP3) /2A
- Power
- 1.0
- Tal

### Library data of the parts
C13 C20 C26 = CAP CER 10uF 10V 10% X5R 0603: CAP CER 10UF 25V 10% X5R 0603; Manufacturer Part Number: C1608X5R1A106K; Manufacturer: TDK Corporation; LANDA P/N: ECP-000008; Voltage - Rated: 10V; RoHS: RoHS Compliant; ComponentLink1URL: http://www.tdk.com/pdf/general_B11.pdf; ComponentLink1Description: http://www.tdk.com/pdf/general_B11.pdf; Package / Case: 0603 (1608 Metric)
C14 C15 C18 C19 C22 C24 C25 = CAP CER 12nF 25V 10% X7R 0402: CAP CER 10nF 25V 10% X5R 0402; Manufacturer Part Number: GRM155R71E123KA61D; Manufacturer: Murata Electronics North America; LANDA P/N: ECP-000042; RoHS: RoHS Compliant; Package / Case: 0402 (1005 Metric); ComponentLink1URL: http://search.murata.co.jp/Ceramy/image/img/PDF/ENG/GRM155R71E123KA61.pdf; ComponentLink1Description: http://search.murata.co.jp/Ceramy/image/img/PDF/ENG/GRM155R71E123KA61.pdf; Voltage - Rated: 25V
C16 C17 C23 C27 = CAP CER 10uF 10V 10% X5R 0603: CAP CER 22UF 16V 10% X5R 0603; Manufacturer Part Number: C1608X5R1A106K; Manufacturer: TDK Corporation; LANDA P/N: ECP-000008; Voltage - Rated: 10V; RoHS: RoHS Compliant; ComponentLink1URL: http://www.tdk.com/pdf/general_B11.pdf; ComponentLink1Description: http://www.tdk.com/pdf/general_B11.pdf; Package / Case: 0603 (1608 Metric)
C21 C28 = CAP CER 6.8pF 50V NP0 0402: CAP CER NA 50V NP0 0402; Manufacturer Part Number: C1005C0G1H6R8D; Manufacturer: TDK Corporation; LANDA P/N: ECP-000033; RoHS: RoHS Compliant; Package / Case: 0402 (1005 Metric); ComponentLink1URL: http://www.tdk.com/pdf/general_B11.pdf; ComponentLink1Description: http://www.tdk.com/pdf/general_B11.pdf; Voltage - Rated: 50V; Capacitance: NA
FB2-FB5 = BK1608HS600-T: as FB1 on sheet main; RoHS: RoHS Compliant; Package / Case: 0603 (1608 Metric); ComponentLink1URL: http://www.yuden.co.jp/ut/product/category/emisuppression/BK1608HS600-T.pdf; ComponentLink1Description: http://www.yuden.co.jp/ut/product/category/emisuppression/BK1608HS600-T.pdf; Manufacturer Part Number: BLM18EG221SN1D
J1 = 1053141204: No Description Available; Mfr_Name: Molex Connector Corporation; Copyright: Copyright (C) 2023 Ultra Librarian. All rights reserved.; Manufacturer_Part_Number: 1053141204; RefDes: RefDes; Type: DEV
LD1 LD2 = APT1608SGC: LED 1.6X0.8MM 568NM GRN CLR SMD; Manufacturer: Kingbright Corp; LANDA P/N: EDI-000006; RoHS: RoHS Compliant; Package / Case: 0603 (1608 Metric); ComponentLink1URL: http://www.us.kingbright.com/images/catalog/SPEC/APT1608SGC.pdf; ComponentLink1Description: http://www.us.kingbright.com/images/catalog/SPEC/APT1608SGC.pdf; Manufacturer Part Number: APT1608SGC
Lp1 = NR6028T100M: INDUCTOR 10UH 1.9A 20% SMD; Manufacturer: Taiyo Yuden; Shielding: Shielded; LANDA P/N: EIN-000003; Package / Case: Non Standard; Size / Dimension: 0.236" L x 0.236" W x 0.110" H (6.00mm x 6.00mm x 2.80mm); RoHS: RoHS Compliant; ComponentLink1URL: http://www.yuden.co.jp/ut/product/category/inductor/NR6028T100M.pdf; ComponentLink1Description: http://www.yuden.co.jp/ut/product/category/inductor/NR6028T100M.pdf; Manufacturer Part Number: NR6028T100M
R27 R30 = RES 15.4K OHM 1/10W 1% 0402 SMD: RES 124K OHM 1/10W 1% 0402 SMD; Manufacturer: Panasonic Electronic Components; Manufacturer Part Number: ERJ-2RKF1542X; Power (Watts): 0.1W, 1/10W; LANDA P/N: ERS-000060; Package / Case: 0402 (1005 Metric); Supplier Device Package: 0402; RoHS: RoHS Compliant; ComponentLink1URL: http://industrial.panasonic.com/www-cgi/jvcr13pz.cgi?E+PZ+3+AOA0002+ERJ2RKF1542X+7+WW; ComponentLink1Description: http://industrial.panasonic.com/www-cgi/jvcr13pz.cgi?E+PZ+3+AOA0002+ERJ2RKF1542X+7+WW
R28 R31 = RES 3.09K OHM 1/16W 1% 0402: RES 1K OHM 1/16W 1% 0402; Manufacturer Part Number: RMCF0402FT3K09; Manufacturer: Stackpole Electronics Inc; Power (Watts): 0.063W, 1/16W; LANDA P/N: ERS-000063; Supplier Device Package: 0402; Package / Case: 0402 (1005 Metric); RoHS: RoHS Compliant; ComponentLink1URL: http://www.seielect.com/Catalog/SEI-RMCF_RMCP.pdf; ComponentLink1Description: http://www.seielect.com/Catalog/SEI-RMCF_RMCP.pdf
R29 = RES 15.4K OHM 1/10W 1% 0402 SMD: RES 39.2K OHM 1/10W 1% 0402 SMD; Manufacturer: Panasonic Electronic Components; Manufacturer Part Number: ERJ-2RKF1542X; Power (Watts): 0.1W, 1/10W; LANDA P/N: ERS-000060; Package / Case: 0402 (1005 Metric); Supplier Device Package: 0402; RoHS: RoHS Compliant; ComponentLink1URL: http://industrial.panasonic.com/www-cgi/jvcr13pz.cgi?E+PZ+3+AOA0002+ERJ2RKF1542X+7+WW; ComponentLink1Description: http://industrial.panasonic.com/www-cgi/jvcr13pz.cgi?E+PZ+3+AOA0002+ERJ2RKF1542X+7+WW
R32 = RES 3.09K OHM 1/16W 1% 0402: RES 100K OHM 1/16W 1% 0402; Manufacturer Part Number: RMCF0402FT3K09; Manufacturer: Stackpole Electronics Inc; Power (Watts): 0.063W, 1/16W; LANDA P/N: ERS-000063; Supplier Device Package: 0402; Package / Case: 0402 (1005 Metric); RoHS: RoHS Compliant; ComponentLink1URL: http://www.seielect.com/Catalog/SEI-RMCF_RMCP.pdf; ComponentLink1Description: http://www.seielect.com/Catalog/SEI-RMCF_RMCP.pdf
TP1-TP3 = TP mini_2: TP PC MINIATURE SMT; Manufacturer: Keystone Electronics; Manufacturer Part Number: 5015; Assembly: N.A; LANDA P/N: ECN-000032; RoHS: RoHS Compliant
U2 U3 = MUN12AD03-SEC: No Description Available; Mfr_Name: Delta; Type: DEV; Copyright: Copyright (C) 2023 Ultra Librarian. All rights reserved.; Manufacturer_Part_Number: MUN12AD03-SEC; RefDes: RefDes

## Nets that join several sheets
GND: main (39 pins), A0 (29 pins), A1 (29 pins), B0 (29 pins), B1 (29 pins), power (26 pins)
P1.8V: main (6 pins), A0 (C39_A0.2 C40_A0.2 U6_A0.1), A1 (C39_A1.2 C40_A1.2 U6_A1.1), B0 (C52_B0.2 C53_B0.2 U8_B0.1), B1 (C52_B1.2 C53_B1.2 U8_B1.1), power (C24.2 FB5.2 R31.2 TP3.1)
P3.3V: main (5 pins), A0 (C37_A0.2 C38_A0.2 U5_A0.1), A1 (C37_A1.2 C38_A1.2 U5_A1.1), B0 (C50_B0.2 C51_B0.2 U7_B0.1), B1 (C50_B1.2 C51_B1.2 U7_B1.1), power (C18.2 FB3.2 R28.2 TP2.1)
AVDD: main (6 pins), A1 (6 pins), B1 (6 pins)
AVDD: main (R18.2 R22.2 R26.2), A0 (6 pins), B0 (6 pins)
CH_N: main (U1.29), A0 (R40_A0.2 T1_A0.3), B0 (R47_B0.2 T2_B0.1)
CH_N: main (U1.35), A1 (R40_A1.2 T1_A1.3), B1 (R47_B1.2 T2_B1.1)
CH_P: main (U1.30), A0 (R39_A0.1 T1_A0.1), B0 (R46_B0.1 T2_B0.3)
CH_P: main (U1.36), A1 (R39_A1.1 T1_A1.1), B1 (R46_B1.1 T2_B1.3)
contr0: A0 (U6_A0.2), B0 (U8_B0.2)
contr1: A1 (U6_A1.2), B1 (U8_B1.2)